# Altium schematic sheet Main.SchDoc
size A4
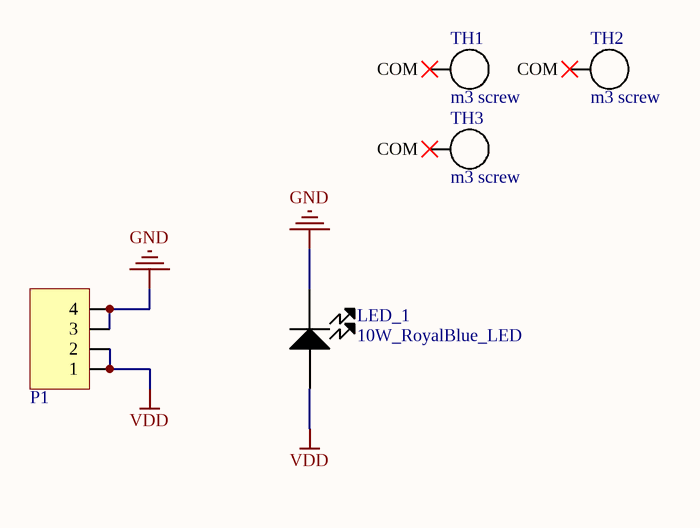
[diagram p0: Main.SchDoc]

## Parts
LED_1  10W_RoyalBlue_LED  [10W_LED_200200]
P1  Mini-Fit Jr 4 Pos  [MOLEX 0039281043]  (value not drawn)
TH1  m3 screw  [m3screw]
TH2  m3 screw  [m3screw]
TH3  m3 screw  [m3screw]

## Nets
GND: LED_1.1(-) P1.3 P1.4
VDD: LED_1.2(+) P1.1 P1.2

Not connected (* = marked no-connect by the designer): TH1 0(COM); TH2 0(COM); TH3 0(COM)

## Library data of the parts
LED_1 = 10W_RoyalBlue_LED: 445nm LED
P1 = Molex 0039281043: Mini-Fit Jr. Header, Dual Row, Right-Angle, with Snap-in Plastic Peg PCB Lock, 6 Circuits, PA Polyamide Nylon 6/6 94V-2, 0.76µm Select Gold (Au) Plating